# Altium schematic sheet adc_AD7714.SchDoc: A 24-bit AD7714YRZ Analog-to-Digital Converter
size A4
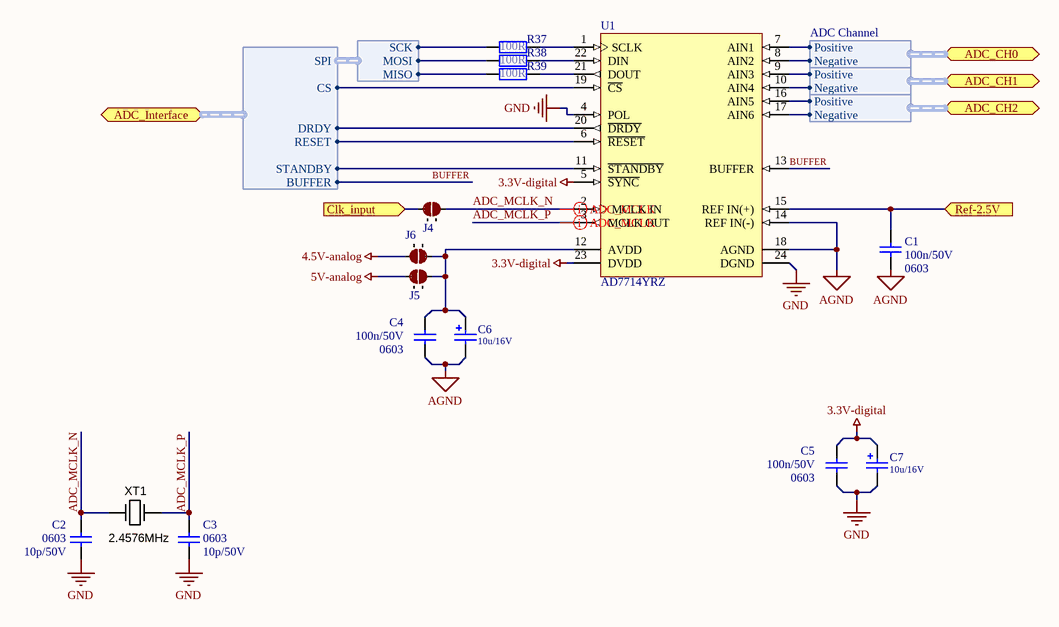
[diagram p0: adc_AD7714.SchDoc]

## Parts
C1  Package: 0603  [SMD_Capacitor_0603]  (hidden comment: 100n/50V)
C2  Package: 0603  [SMD_Capacitor_0603]  (hidden comment: 10p/50V)
C3  Package: 0603  [SMD_Capacitor_0603]  (hidden comment: 10p/50V)
C4  Package: 0603  [SMD_Capacitor_0603]  (hidden comment: 100n/50V)
C5  Package: 0603  [SMD_Capacitor_0603]  (hidden comment: 100n/50V)
C6  10u/16V  [Tantalum_cap_B]
C7  10u/16V  [Tantalum_cap_B]
J4  2 way net solder junction - Normally Open  [2waySolder_NO - 20 mils]  (value not drawn)  (no BOM)
J5  2 way net solder junction - Normally Open  [2waySolder_NO - 20 mils]  (value not drawn)  (no BOM)
J6  2 way net solder junction - Normally Open  [2waySolder_NO - 20 mils]  (value not drawn)  (no BOM)
R37  100R  [0603]
R38  100R  [0603]
R39  100R  [0603]
U1  AD7714YRZ  [RW-24_M]
XT1  2.4576MHz  [HC49U]

## Ports
ADC_CH0 (harness ADC Channel), ADC_CH1 (harness ADC Channel), ADC_CH2 (harness ADC Channel), ADC_Interface (harness ADC_DIGITAL), Clk_input (in), Ref-2.5V (in)

## Harnesses
ADC_DIGITAL: DRDY, RESET, STANDBY, BUFFER, CS, SPI
SPI: SCK, MOSI, MISO
ADC Channel: Positive, Negative

## Nets
3.3V-digital: C5.1 C7.1 U1.5(~{SYNC}) U1.23(DVDD)
4.5V-analog: J6.2
5V-analog: J5.1
AGND: C1.2 C4.2 C6.2 U1.14(REF_IN(-)) U1.18(AGND)
GND: C2.2 C3.2 C5.2 C7.2 U1.4(POL) U1.24(DGND)
ADC_MCLK_N: C2.1 J4.2 U1.2(MCLK_IN) XT1.1(IN)
ADC_MCLK_P: C3.1 U1.3(MCLK_OUT) XT1.2(OUT)
BUFFER: U1.13(BUFFER) ; port ADC_Interface.BUFFER
Clk_input: J4.1 ; port Clk_input
Ref-2.5V: C1.1 U1.15(REF_IN(+)) ; port Ref-2.5V
NetC4_1: C4.1 C6.1 J5.2 J6.1 U1.12(AVDD)
NetR37_1: R37.1 ; harness SPI.SCK
NetR37_2: R37.2 U1.1(SCLK)
NetR38_1: R38.1 ; harness SPI.MOSI
NetR38_2: R38.2 U1.22(DIN)
NetR39_1: R39.1 ; harness SPI.MISO
NetR39_2: R39.2 U1.21(DOUT)
NetU1_6: U1.6(~{RESET}) ; port ADC_Interface.RESET
NetU1_7: U1.7(AIN1) ; port ADC_CH0.Positive
NetU1_8: U1.8(AIN2) ; port ADC_CH0.Negative
NetU1_9: U1.9(AIN3) ; port ADC_CH1.Positive
NetU1_10: U1.10(AIN4) ; port ADC_CH1.Negative
NetU1_11: U1.11(~{STANDBY}) ; port ADC_Interface.STANDBY
NetU1_16: U1.16(AIN5) ; port ADC_CH2.Positive
NetU1_17: U1.17(AIN6) ; port ADC_CH2.Negative
NetU1_19: U1.19(~{CS}) ; port ADC_Interface.CS
NetU1_20: U1.20(~{DRDY}) ; port ADC_Interface.DRDY

## Layout directives
differential pair: ADC_MCLK_N, ADC_MCLK_P

## Notes on the sheet
- Title:
- Sheet:
- of
- Author:
- Model:
- Document Number:
- Checked by:
- Iss-Rev:
- Approved by:
- Date:
- File name:

## Library data of the parts
C1 C4 C5 = Cer_C0603T104K5RALTU: Ceramic Cap Kemet COTS 100n/50V X7R 0603; Manufacturer: Kemet; ManufacturerPartNumber: C0603T104K5RALTU; Value: 100n/50V
C2 C3 = Cer_GCM1885C1H100JA16D: Ceramic Cap Murata Automotive 10p/50V C0G 0603; Manufacturer: Murata; ManufacturerPartNumber: GCM1885C1H100JA16D; Value: 10p/50V
C6 C7 = Cap Tantalum: Tantalum Capacitor; Value: 10u/16V
J4-J6 = 2waySolderNO: ComponentLink1URL: http://www.edatools.cz/addons; ComponentLink1Description: Source
R37-R39 = Res: Generic resistor; value: 100R
U1 = AD7714YRZ: 5 Channel 24-Bit Signal Conditioning Analog-to-Digital Converter with Serial, SPI Interface, 500 uA, CMOS, 3 V / 5 V, 1KSPS, -40 to +105 degC, RW-24, Pb-Free, Tube; Generic Part Number: AD7714; Manufacturer: Analog Devices; Resolution (Bits): 24; Channels: 5; Throughput Rate (SPS): 1K; Interface: Ser, SPI; DatasheetVersion: Rev.C; PackageVersion: 060706-A; PackageReference: RW-24; PackageDescription: 24-Lead Standard Small Outline Package [SOIC_W]; Supplier 1: Digi-Key; Supplier Part Number 1: AD7714YRZ-ND; Supplier 2: Farnell; Supplier Part Number 2: 1438858; Supplier 3: Newark; Supplier Part Number 3: 15P0854; Supplier 4: Newark; Supplier Part Number 4: 59K5335; Supplier 5: Mouser; Supplier Part Number 5: 584-AD7714YRZ; RoHS: Y; Packing: Tube; Mounting Technology: Surface Mount; Code_JEDEC: MS-013-AD; PartNumber: AD7714YRZ; ComponentLink1Description: Manufacturer URL; ComponentLink1URL: http://www.analog.com/en/index.html; ComponentLink2Description: Datasheet; ComponentLink2URL: http://www.analog.com/static/imported-files/data_sheets/AD7714.pdf; ComponentLink3Description: Package Specification; ComponentLink3URL: http://www.analog.com/static/imported-files/packages/33665150946139RW_24.pdf; ComponentLink4Description: Product URL; ComponentLink4URL: http://www.analog.com/en/analog-to-digital-converters/ad-converters/ad7714/products/product.html
XT1 = Crystal: AKER  C-2.4576-18-3050-X; Manufacturer 1: Citizen Finetech Miyota; Manufacturer Part Number 1: CMR309T-6.000MABJ-UT; Ratings: 6.00 MHz; Frequency: 6MHz; Frequency Stability: ±50ppm; Frequency Tolerance: ±30ppm; Load Capacitance: 18pF; Operating Mode: Fundamental; SCDType: spec; Package / Case: Cylindrical Can, Radial; Type: MHz Crystal; Operating Temperature: -10°C ~ 60°C; Mounting Type: Surface Mount; Size / Dimension: 0.118" Dia x 0.346" L (3.00mm x 8.80mm); Height: 0.122" (3.10mm); Supplier 1: Digi-Key; Supplier Part Number 1: 300-8348-1-ND; Tolerance: ±50ppm; ComponentLink1URL: http://media.digikey.com/pdf/Data%20Sheets/Citizen%20PDFs/CMR310T%20CMR309T.pdf; ComponentLink1Description: http://media.digikey.com/pdf/Data%20Sheets/Citizen%20PDFs/CMR310T%20CMR309T.pdf; Value: 2.4576MHz